# EasyEDA Pro project 毕业设计PCB板.eprj, schematic STM32103C8T6
Board Name: Board1; Create Date: 2024-12-30; Page Name: P1; Project Name: 毕业设计PCB板; Schematic Name: STM32103C8T6; Update Date: 2025-01-07; Add into BOM: yes; Company: 轻歌有限公司; Convert to PCB: yes; Page Size: A4; Version: V1.0
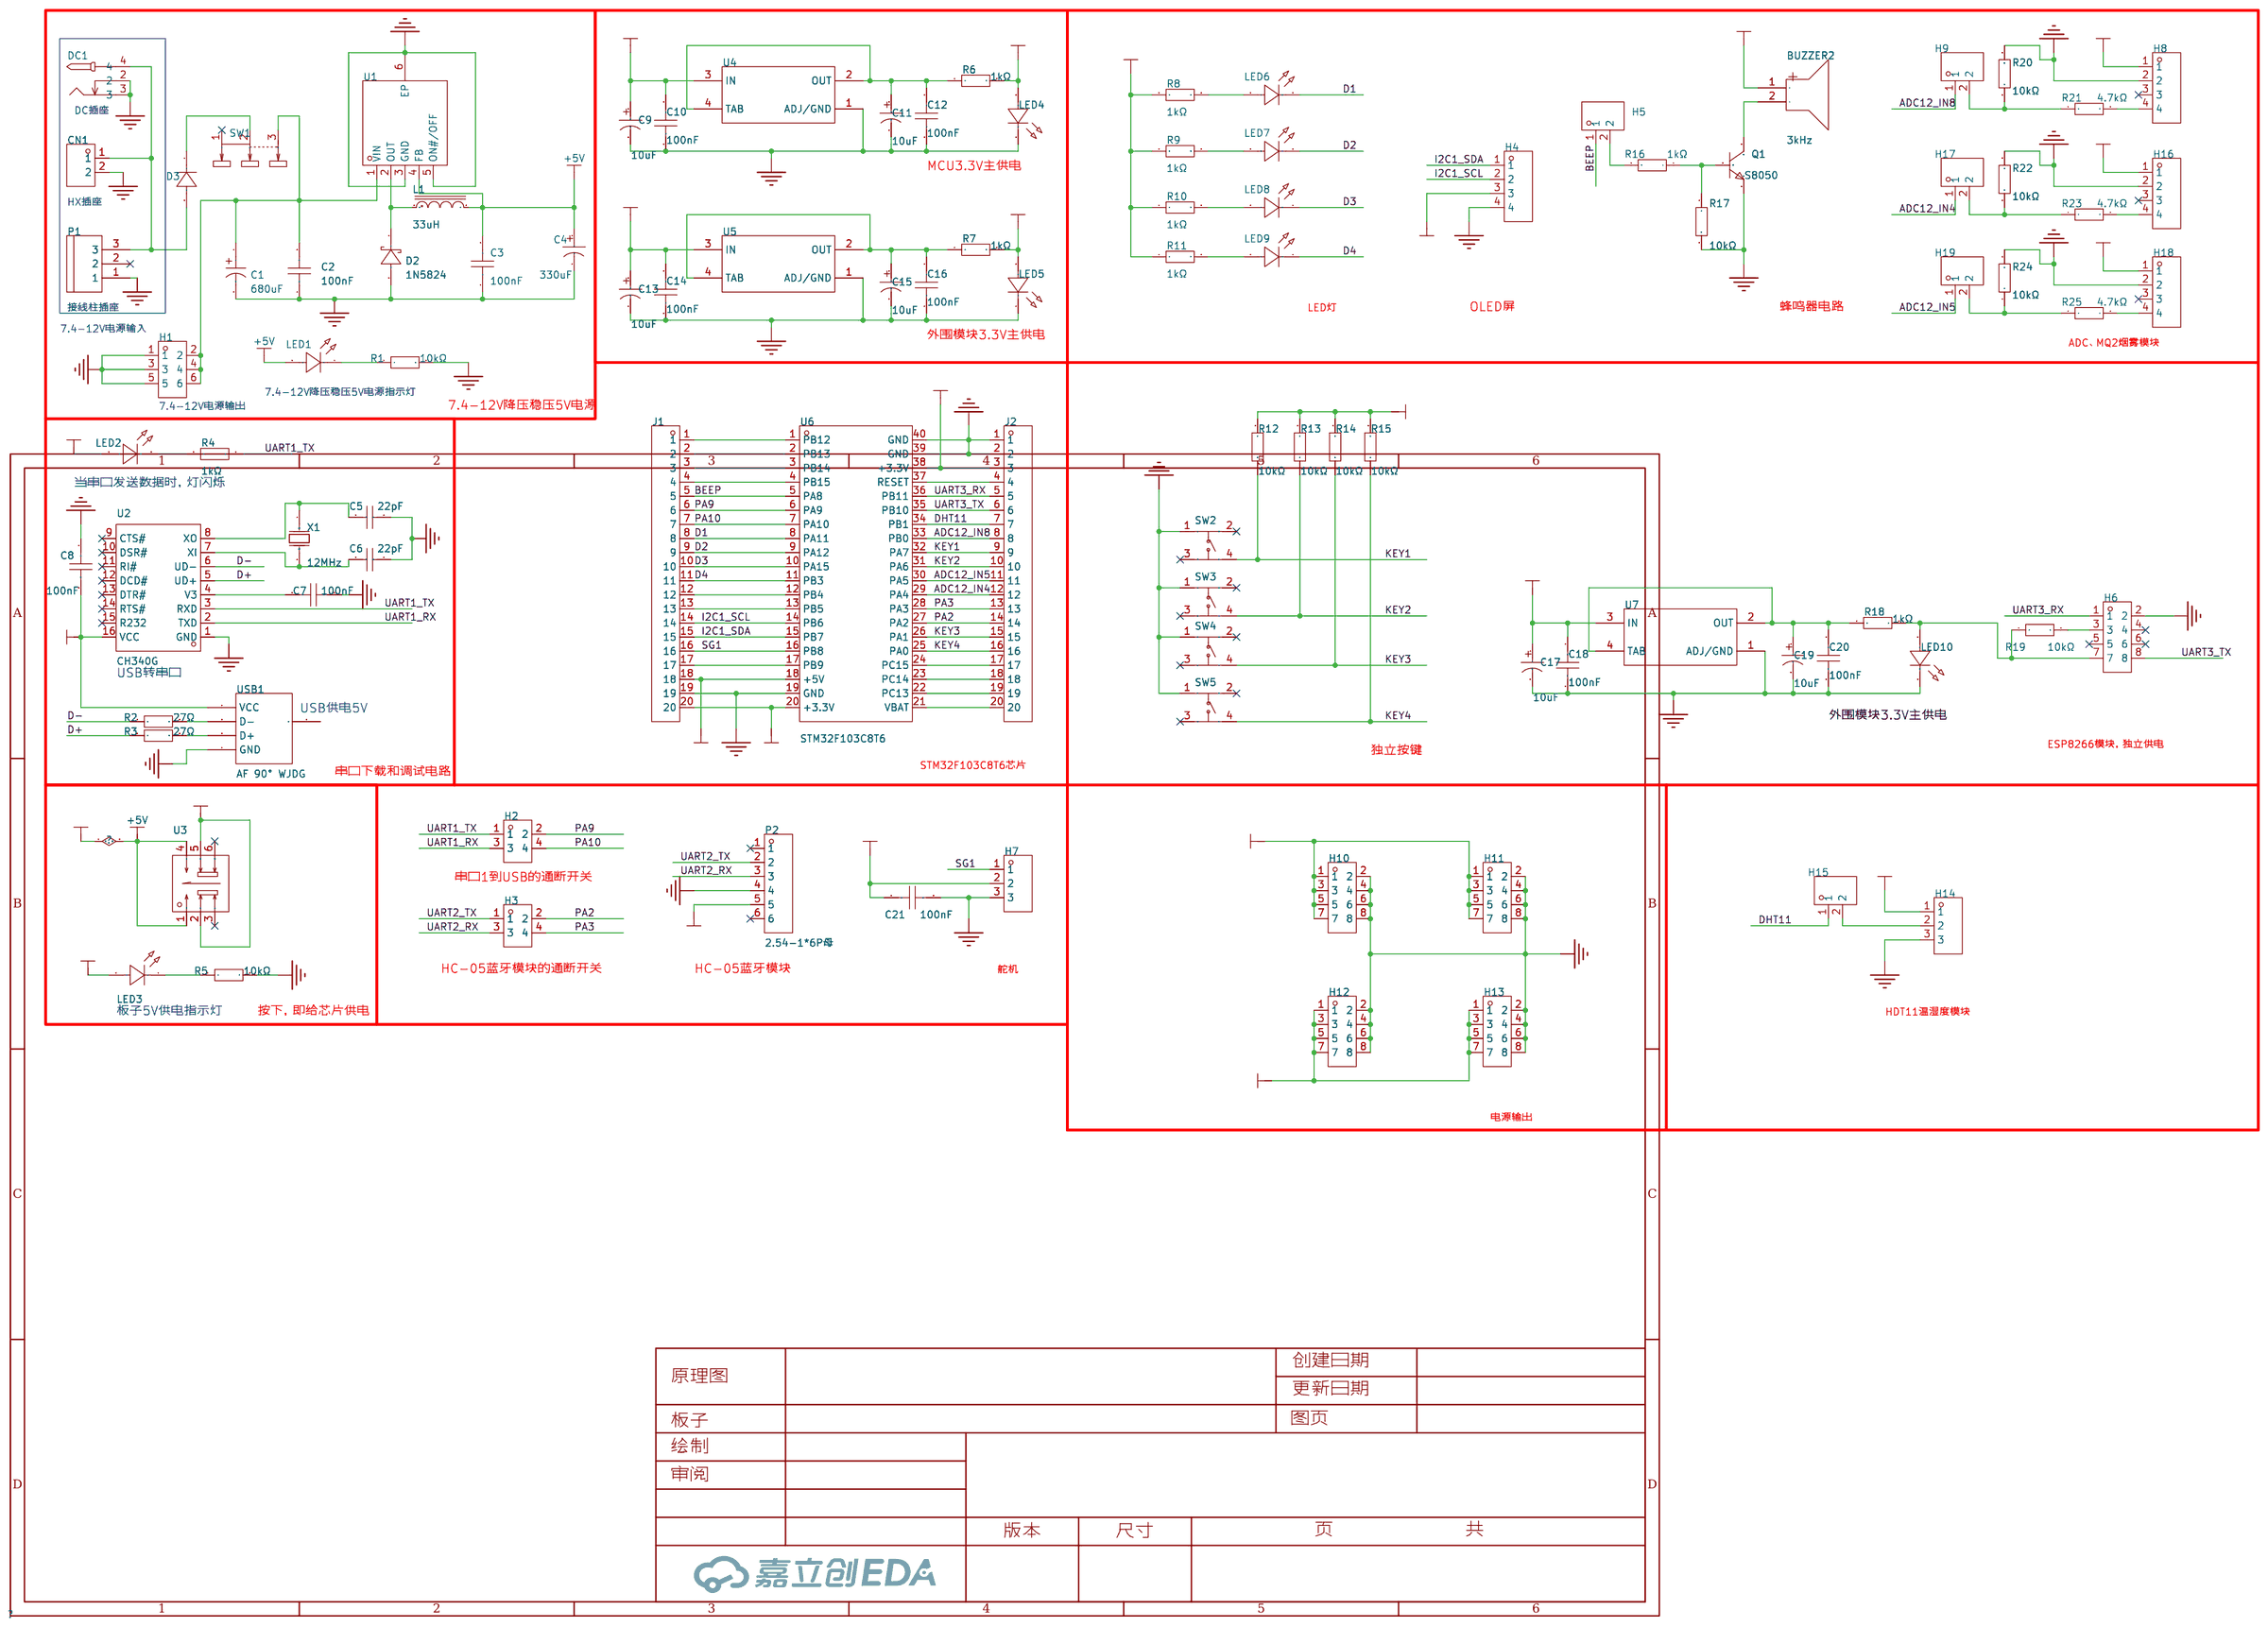
[diagram p0: schematic sheet]

## Parts
BUZZER2  3kHz  [BUZ-TH_BD9.0-P5.00-D0.6-FD]
C1  680uF  [CAP-TH_BD10.0-P5.00-D0.6-FD]
C2  100nF  [C0805]
C3  100nF  [C0805]
C4  330uF  [CAP-TH_BD8.0-P3.50-D0.6-FD]
C5  22pF  [C0805]
C6  22pF  [C0805]
C7  100nF  [C0805]
C8  100nF  [C0805]
C9  10uF  [CAP-TH_BD5.0-P2.00-D0.8-FD]
C10  100nF  [C0805]
C11  10uF  [CAP-TH_BD5.0-P2.00-D0.8-FD]
C12  100nF  [C0805]
C13  10uF  [CAP-TH_BD5.0-P2.00-D0.8-FD]
C14  100nF  [C0805]
C15  10uF  [CAP-TH_BD5.0-P2.00-D0.8-FD]
C16  100nF  [C0805]
C17  10uF  [CAP-TH_BD5.0-P2.00-D0.8-FD]
C18  100nF  [C0805]
C19  10uF  [CAP-TH_BD5.0-P2.00-D0.8-FD]
C20  100nF  [C0805]
C21  100nF  [C0805]
CN1  HX25003-2A  [CONN-TH_2P-P2.50_HX25003-2A]
D2  1N5824  [DO-27_BD5.3-L8.4-P12.40-D1.3-RD]
D3  1N4007  [DO-41_BD2.4-L4.7-P8.70-D0.8-RD]
DC1  DC-005 2.0  [DC-IN-TH_DC-5520-1]
H1  PZ254-2-03-Z-8.5  [HDR-TH_6P-P2.54-V-M-R2-C3-S2.54]
H2  PZ254V-12-4P  [HDR-TH_4P-P2.54-V-M-R2-C2-S2.54]
H3  PZ254V-12-4P  [HDR-TH_4P-P2.54-V-M-R2-C2-S2.54]
H4  2.54-1*4P母  [HDR-TH_4P-P2.54-V-F]
H5  PZ254V-11-02P  [HDR-TH_2P-P2.54-V-M]
H6  PM254V-12-08-H85  [HDR-TH_8P-P2.54-V-F-R2-C4-S2.54]
H7  PZ254V-11-03P  [HDR-TH_3P-P2.54-V-M]
H8  2.54-1*4P母  [HDR-TH_4P-P2.54-V-F]
H9  PZ254V-11-02P  [HDR-TH_2P-P2.54-V-M]
H10  PZ254V-12-8P  [HDR-TH_8P-P2.54-V-M-R2-C4-S2.54]
H11  PZ254V-12-8P  [HDR-TH_8P-P2.54-V-M-R2-C4-S2.54]
H12  PZ254V-12-8P  [HDR-TH_8P-P2.54-V-M-R2-C4-S2.54]
H13  PZ254V-12-8P  [HDR-TH_8P-P2.54-V-M-R2-C4-S2.54]
H14  PM254V-11-03-H85  [HDR-TH_3P-P2.54-V-F]
H15  PZ254V-11-02P  [HDR-TH_2P-P2.54-V-M]
H16  2.54-1*4P母  [HDR-TH_4P-P2.54-V-F]
H17  PZ254V-11-02P  [HDR-TH_2P-P2.54-V-M]
H18  2.54-1*4P母  [HDR-TH_4P-P2.54-V-F]
H19  PZ254V-11-02P  [HDR-TH_2P-P2.54-V-M]
J1  2.54-1*20P直针  [HDR-TH_20P-P2.54-V-M-1]
J2  2.54-1*20P直针  [HDR-TH_20P-P2.54-V-M-1]
L1  33uH  [IND-TH_BD7.5-P3.00-D0.6]
LED1  XL-302SURD  [LED-TH_BD3.8-P2.54-RD]
LED2  XL-302SURD  [LED-TH_BD3.8-P2.54-RD]
LED3  XL-302SURD  [LED-TH_BD3.8-P2.54-RD]
LED4  XL-302SURD  [LED-TH_BD3.8-P2.54-RD]
LED5  XL-302SURD  [LED-TH_BD3.8-P2.54-RD]
LED6  XL-302SURD  [LED-TH_BD3.8-P2.54-RD]
LED7  XL-302SURD  [LED-TH_BD3.8-P2.54-RD]
LED8  XL-302SURD  [LED-TH_BD3.8-P2.54-RD]
LED9  XL-302SURD  [LED-TH_BD3.8-P2.54-RD]
LED10  XL-302SURD  [LED-TH_BD3.8-P2.54-RD]
P1  WJ500V-5.08-3P  [CONN-TH_3P-P5.00_WJ500V-5.08-3P]
P2  2.54-1*6P母  [HDR-TH_6P-P2.54-V-F]
Q1  S8050  [TO-92-3_L4.5-W3.5-P1.27-L]
R1  10kΩ  [R0805]
R2  27Ω  [R0805]
R3  27Ω  [R0805]
R4  1kΩ  [R0805]
R5  10kΩ  [R0805]
R6  1kΩ  [R0805]
R7  1kΩ  [R0805]
R8  1kΩ  [R0805]
R9  1kΩ  [R0805]
R10  1kΩ  [R0805]
R11  1kΩ  [R0805]
R12  10kΩ  [R0805]
R13  10kΩ  [R0805]
R14  10kΩ  [R0805]
R15  10kΩ  [R0805]
R16  1kΩ  [R0805]
R17  10kΩ  [R0805]
R18  1kΩ  [R0805]
R19  10kΩ  [R0805]
R20  10kΩ  [R0805]
R21  4.7kΩ  [R0805]
R22  10kΩ  [R0805]
R23  4.7kΩ  [R0805]
R24  10kΩ  [R0805]
R25  4.7kΩ  [R0805]
SW1  SS-12D10L5  [SW-TH_SS-12D10L5]
SW2  KH-6X6X5H-STM  [SW-SMD_4P-L6.0-W6.0-P4.50-LS9.0-2]
SW3  KH-6X6X5H-STM  [SW-SMD_4P-L6.0-W6.0-P4.50-LS9.0-2]
SW4  KH-6X6X5H-STM  [SW-SMD_4P-L6.0-W6.0-P4.50-LS9.0-2]
SW5  KH-6X6X5H-STM  [SW-SMD_4P-L6.0-W6.0-P4.50-LS9.0-2]
U1  LM2596S-5.0  [TO-263-5_L10.2-W8.9-P1.70-BR]
U2  CH340G  [SOIC-16_L9.9-W3.9-P1.27-LS6.0-BL]
U3  PS-7054DVB-6PL  [SW-TH_6P-L7.0-W7.0-P2.00]
U4  LM1117S-3.3  [SOT-223-3_L6.5-W3.4-P2.30-LS7.0-BR]
U5  LM1117S-3.3  [SOT-223-3_L6.5-W3.4-P2.30-LS7.0-BR]
U6  STM32F103C8T6  [CONN-TH_L53.3-W22.9_STM32F103C8T6-CARD]
U7  LM1117S-3.3  [SOT-223-3_L6.5-W3.4-P2.30-LS7.0-BR]
USB1  AF 90° WJDG  [USB-A-TH_AF-WJDG]
X1  12MHz  [HC-49US_L11.5-W4.5-P4.88]

## Library data of the parts
BUZZER2 = HNB09A03: LCSC Part Name: 电磁式有源一体蜂鸣器HNB09A03; Supplier Part: C96102; Manufacturer: 华能; Supplier Footprint: 插件,D=9mm; JLCPCB Part Class: 扩展库; Datasheet: https://atta.szlcsc.com/upload/public/pdf/source/20170522/1495448326172.pdf; Supplier: LCSC; Oscillator Circuit: 有源(内含驱动线路); Technology Type: 电磁式; Operating Voltage: 1.5V~4.5V; Current Consumption: 30mA; Sound Pressure Level (SPL): 85dB@10cm; Diameter (φD): 9mm; Height: 5.5mm; Operating Temperature: -20℃~+70℃
C1 = ERS1VM681G16OT: LCSC Part Name: 680uF ±20% 35V; Supplier Part: C721283; Manufacturer: AISHI(艾华集团); Supplier Footprint: 插件,D10xL16mm; JLCPCB Part Class: 扩展库; Datasheet: https://atta.szlcsc.com/upload/public/pdf/source/20191015/C438940_4B8E60A742BB0AE40DDEF87A5C89089D.pdf; Supplier: LCSC; Tolerance: ±20%; Rated Voltage: 35V
C2 C3 C7 C8 C10 C12 C14 C16 C18 C20 C21 = CC0805KRX7R9BB104: LCSC Part Name: 100nF ±10% 50V; Supplier Part: C49678; Manufacturer: YAGEO(国巨); Supplier Footprint: 0805; JLCPCB Part Class: 基础库; Datasheet: https://atta.szlcsc.com/upload/public/pdf/source/20180224/C181747_15194369449651363981.pdf; Supplier: LCSC; Tolerance: ±10%; Voltage Rated: 50V; Temperature Coefficient: X7R
C4 = KM337M025F12RR0VH2FP0: LCSC Part Name: 330uF ±20% 25V; Supplier Part: C2051; Manufacturer: CX(承兴); Supplier Footprint: 插件,D8xL12mm; JLCPCB Part Class: 扩展库; Datasheet: https://atta.szlcsc.com/upload/public/pdf/source/20211027/06D6BA3719C264B639DC286D935D03EA.pdf; Supplier: LCSC; Tolerance: ±20%; Rated Voltage: 25V; Ripple Current: 340mA@120Hz; Lead Spacing: 3.5mm; φD: 8mm; L: 12mm; Lifetime @ Temp: 2000hrs@105℃
C5 C6 = CL21C220JBANNNC: LCSC Part Name: 22pF ±5% 50V; Supplier Part: C1804; Manufacturer: SAMSUNG(三星); Supplier Footprint: 0805; JLCPCB Part Class: 基础库; Datasheet: https://atta.szlcsc.com/upload/public/pdf/source/20160218/1457707763339.pdf; Supplier: LCSC; Tolerance: ±5%; Voltage Rated: 50V; Temperature Coefficient: C0G
C9 C11 C13 C15 C17 C19 = ERS1HM100D11OT: LCSC Part Name: 10uF ±20% 50V; Supplier Part: C106654; Manufacturer: AISHI(艾华集团); Supplier Footprint: 插件,D5xL11mm; JLCPCB Part Class: 扩展库; Datasheet: https://atta.szlcsc.com/upload/public/pdf/source/20191015/C438940_4B8E60A742BB0AE40DDEF87A5C89089D.pdf; Supplier: LCSC; Tolerance: ±20%; Rated Voltage: 50V; Lead Spacing: 2mm; φD: 5mm; L: 11mm; Lifetime @ Temp: 5000hrs@105℃
CN1 = HX25003-2A: LCSC Part Name: 1x2P 间距:2.5mm 直插 系列:XH; Supplier Part: C442299; Manufacturer: HX(红星); Supplier Footprint: 插件,P=2.5mm; JLCPCB Part Class: 扩展库; Datasheet: https://atta.szlcsc.com/upload/public/pdf/source/20191028/C442312_1520F9194999EF6509032948661325F7.pdf; Supplier: LCSC; Pins Structure: 1x2P; Pitch: 2.5mm; Mounting Style: 直插; Reference Series: XH; Number of Pins: 2P; Number of Rows: 1; Number of PINs Per Row: 2
D2 = 1N5824_C7503125: LCSC Part Name: 电压:30V 电流:5A; Supplier Part: C7503125; Manufacturer: FUXINSEMI(富芯森美); Supplier Footprint: DO-201AD; JLCPCB Part Class: 扩展库; Datasheet: https://atta.szlcsc.com/upload/public/pdf/source/20230904/20F3394C6D1B7A17743713246CA97DB3.pdf; Supplier: LCSC; Diode Configuration: 独立式; Forward Voltage (Vf@If): 550mV@5A; Reverse Voltage (Vr): 30V; Average Rectified Current (Io): 5A; Reverse Leakage Current (Ir): 500uA@30V; Peak forward surge current: 150A
D3 = 1N4007_C2985028: Supplier Part: C2985028; Manufacturer: GOODWORK(固得沃克); Supplier Footprint: DO-41; JLCPCB Part Class: 扩展库; Datasheet: https://atta.szlcsc.com/upload/public/pdf/source/20240805/02ED96714CFF9D9B94990135524CCB2D.pdf; Supplier: LCSC; Diode Configuration: 独立式; Forward Voltage (Vf@If): 1V@1A; Reverse Voltage (Vr): 1kV; Rectified Current: 1A; Reverse Leakage Current (Ir): 5uA@1kV
DC1 = DC-005 2.0: LCSC Part Name: DC电源插座 内径:2mm 外径:6.4mm; Supplier Part: C16214; Manufacturer: BOOMELE(博穆精密); Supplier Footprint: 插件; JLCPCB Part Class: 扩展库; Datasheet: https://atta.szlcsc.com/upload/public/pdf/source/20230822/A395081E7D04348211A5D528B2AFD8E0.pdf; Supplier: LCSC; Connector Type: DC电源插座; Mounting Style: 弯插; Inside Contact Diameter: 2mm; Outside Contact Diameter: 6.4mm; Current Rating (Max): 1A; Voltage Rating (Max): 12V; Operating Temperature Range: -25℃~+85℃
H1 = PZ254-2-03-Z-8.5_C2894964: LCSC Part Name: 2x3P 间距:2.54mm 方针 直插; Supplier Part: C2894964; Manufacturer: HCTL(华灿天禄); Supplier Footprint: 插件,P=2.54mm; JLCPCB Part Class: 扩展库; Datasheet: https://atta.szlcsc.com/upload/public/pdf/source/20230609/5BA09C8BEB9B31376F8BF6032FF67CAC.pdf; Supplier: LCSC; Pin Structure: 2x3P; Pitch: 2.54mm; Row Spacing: 2.54mm; Circluar Pins/Square Pins: 方针; Mounting Type: 直插; Number of Rows: 双排; Number of Pins: 6P; Current Rating (Max): 3A; Length of Mating Pin: 6mm; Insulation Height: 2.5mm; Length of End Connection Pin: 3mm; Contact Material: 黄铜; Operating Temperature Range: -40℃~+105℃; Soldering Temperature(Max): 260℃@10S; Color: 黑色
H2 H3 = PZ254V-12-4P: LCSC Part Name: 间距:2.54mm 2x2P 直插 方针; Supplier Part: C492419; Manufacturer: XFCN(兴飞); Supplier Footprint: 插件,P=2.54mm; JLCPCB Part Class: 扩展库; Datasheet: https://atta.szlcsc.com/upload/public/pdf/source/20200309/C492419_0001C06E73AFF21BD0ED3D7CEEF46D29.pdf; Supplier: LCSC; Pin Structure: 2x2P; Pitch: 2.54mm; Row Spacing: 2.54mm; Circluar Pins/Square Pins: 方针; Mounting Type: 直插; Number of Rows: 双排; Number of Pins: 4P; Length of Mating Pin: 6mm; Insulation Height: 2.5mm; Length of End Connection Pin: 3mm; Contact Material: 黄铜; Operating Temperature Range: -40℃~+105℃; Color: 黑色
H4 H8 H16 H18 = 2.54-1*4P母: LCSC Part Name: 间距:2.54mm 1x4P 直插; Supplier Part: C2718488; Manufacturer: BOOMELE(博穆精密); Supplier Footprint: 插件,P=2.54mm; JLCPCB Part Class: 扩展库; Datasheet: https://atta.szlcsc.com/upload/public/pdf/source/20210301/C2718488_F4427B881E42CAA8DDB0B1C12B3A522C.pdf; Supplier: LCSC; Holes Structure: 1x4P; Pitch: 2.54mm; Circular Hole / Square Hole: 方孔; Mounting Type: 直插; Number of Rows: 单排; Number of Holes: 4P; Current Rating (Max): 3A; Holes Direction: 顶部; Contact Material: 青铜; Operating Temperature Range: -40℃~+105℃
H5 H9 H15 H17 H19 = PZ254V-11-02P: LCSC Part Name: 间距:2.54mm 1x2P 直插 方针; Supplier Part: C492401; Manufacturer: XFCN(兴飞); Supplier Footprint: 插件,P=2.54mm; JLCPCB Part Class: 扩展库; Datasheet: https://atta.szlcsc.com/upload/public/pdf/source/20200309/C492401_A812433581A9B211A7FFA413ADDFF0E5.pdf; Supplier: LCSC; Pin Structure: 1x2P; Pitch: 2.54mm; Circluar Pins/Square Pins: 方针; Mounting Type: 直插; Number of Rows: 单排; Number of Pins: 2P; Length of Mating Pin: 6mm; Insulation Height: 2.5mm; Length of End Connection Pin: 3mm; Contact Material: 黄铜; Operating Temperature Range: -40℃~+105℃; Color: 黑色
H6 = PM254V-12-08-H85: LCSC Part Name: 间距:2.54mm 2x4P 直插; Supplier Part: C2834799; Manufacturer: XFCN(兴飞); Supplier Footprint: 插件,P=2.54mm; JLCPCB Part Class: 扩展库; Datasheet: https://atta.szlcsc.com/upload/public/pdf/source/20200309/C492399_8C441E2934FBB604A89B37A68AA45ECF.pdf; Supplier: LCSC; Holes Structure: 2x4P; Pitch: 2.54mm; Row Spacing: 2.54mm; Circular Hole / Square Hole: 方孔; Mounting Type: 直插; Number of Rows: 双排; Number of Holes: 8P; Current Rating (Max): 3A; Voltage Rating (Max): 250V; Holes Direction: 顶部; Insulation Height: 8.5mm; Operating Temperature Range: -40℃~+105℃
H7 = PZ254V-11-03P: LCSC Part Name: 间距:2.54mm 1x3P 直插 方针; Supplier Part: C2937625; Manufacturer: XFCN(兴飞); Supplier Footprint: 插件,P=2.54mm; JLCPCB Part Class: 扩展库; Datasheet: https://atta.szlcsc.com/upload/public/pdf/source/20200309/C492402_8335C3D49C4E4C618838D59BB1D024C1.pdf; Supplier: LCSC; Pin Structure: 1x3P; Pitch: 2.54mm; Circluar Pins/Square Pins: 方针; Mounting Type: 直插; Number of Rows: 单排; Number of Pins: 3P; Current Rating (Max): 3A; Voltage Rating (Max): 250V; Length of Mating Pin: 6mm; Insulation Height: 2.5mm; Length of End Connection Pin: 3mm; Operating Temperature Range: -40℃~+105℃; Color: 黑色
H10-H13 = PZ254V-12-8P: LCSC Part Name: 间距:2.54mm 2x4P 直插 方针; Supplier Part: C492421; Manufacturer: XFCN(兴飞); Supplier Footprint: 插件,P=2.54mm; JLCPCB Part Class: 扩展库; Datasheet: https://atta.szlcsc.com/upload/public/pdf/source/20200309/C492421_DC8A206AF99CD7755BD4A5B0BC48200B.pdf; Supplier: LCSC; Pin Structure: 2x4P; Pitch: 2.54mm; Row Spacing: 2.54mm; Circluar Pins/Square Pins: 方针; Mounting Type: 直插; Number of Rows: 双排; Number of Pins: 8P; Length of Mating Pin: 6mm; Insulation Height: 2.5mm; Length of End Connection Pin: 3mm; Contact Material: 黄铜; Operating Temperature Range: -40℃~+105℃; Color: 黑色
H14 = PM254V-11-03-H85: LCSC Part Name: 间距:2.54mm 1x3P 直插; Supplier Part: C541850; Manufacturer: XFCN(兴飞); Supplier Footprint: 插件,P=2.54mm; JLCPCB Part Class: 扩展库; Datasheet: https://atta.szlcsc.com/upload/public/pdf/source/20200518/C541849_85853D71FC67C51915A806977A588FDA.pdf; Supplier: LCSC; Holes Structure: 1x3P; Pitch: 2.54mm; Mounting Type: 直插; Number of Rows: 单排; Number of Holes: 3P; Contact Material: 黄铜
J1 J2 = 2.54-1*20P直针: LCSC Part Name: 间距:2.54mm 1x20P 直插 方针; Supplier Part: C50981; Manufacturer: BOOMELE(博穆精密); Supplier Footprint: 插件,P=2.54mm; JLCPCB Part Class: 扩展库; Datasheet: https://atta.szlcsc.com/upload/public/pdf/source/20151109/1457707572883.pdf; Supplier: LCSC; Pin Structure: 1x20P; Pitch: 2.54mm; Circluar Pins/Square Pins: 方针; Mounting Type: 直插; Number of Rows: 单排; Number of Pins: 20P; Current Rating (Max): 3A; Contact Material: 黄铜; Operating Temperature Range: -40℃~+105℃; Color: 黑色
L1 = PDPTAT0608-330M: LCSC Part Name: 33uH ±20% 1.7A 工字电感; Supplier Part: C5119594; Manufacturer: PROD(谱罗德); Supplier Footprint: 插件,D7.5xL10mm; JLCPCB Part Class: 扩展库; Datasheet: https://atta.szlcsc.com/upload/public/pdf/source/20220811/05DB99A2C788B818DCFC0C4B53D9481B.pdf; Supplier: LCSC; Tolerance: ±20%; Current - Saturation (Isat): 1.7A; DC Resistance: 90mΩ; Type: 工字电感
LED1-LED10 = XL-302SURD: Supplier Part: C2895470; Manufacturer: XINGLIGHT(成兴光); Supplier Footprint: 插件,D=3mm; JLCPCB Part Class: 扩展库; Datasheet: https://atta.szlcsc.com/upload/public/pdf/source/20240112/E1E2B82945FD635E4907401DDE6D4922.pdf; Supplier: LCSC; Lamp Holder Type: 3mm圆形灯头; Emitted Color: 红色; Power Dissipation: 80mW; Forward Current: 30mA; Dominant Wavelength: 615nm~620nm; Peak Wavelength: 625nm; Lens Color: 红色透镜; Viewing Angle: 50°; Operating Temperature: -25℃~+85℃
P1 = WJ500V-5.08-3P: LCSC Part Name: 5.08mm 1x3P 排数:1 每排P数:3 直插; Supplier Part: C72334; Manufacturer: KANGNEX(康奈克斯电气); Supplier Footprint: 插件,P=5.08mm; JLCPCB Part Class: 扩展库; Datasheet: https://atta.szlcsc.com/upload/public/pdf/source/20191225/C72334_8A5EF831D67650233B6B1E3F2BC06274.pdf; Supplier: LCSC; Structure: 1x3P; Pitch: 5.08mm; Color: 绿色; Mounting Style: 直插; Current Rating (Max): 18A; Voltage Rating (Max): 250V; Number of Pins: 3P; Number of Rows: 1; Wire Gauge - AWG: 14~30; Wire Gauge - mm2: 2.5; Number of PINs Per Row: 3; Operating Temperature Range: -40℃~+105℃
P2 = 2.54-1*6P母: LCSC Part Name: 间距:2.54mm 1x6P 直插; Supplier Part: C40877; Manufacturer: BOOMELE(博穆精密); Supplier Footprint: 插件,P=2.54mm; JLCPCB Part Class: 扩展库; Datasheet: https://atta.szlcsc.com/upload/public/pdf/source/20210301/C2718488_F4427B881E42CAA8DDB0B1C12B3A522C.pdf; Supplier: LCSC; Holes Structure: 1x6P; Pitch: 2.54mm; Mounting Type: 直插; Number of Rows: 单排; Number of Holes: 6P
Q1 = S8050_C2931492: LCSC Part Name: NPN 电流:500mA 耐压:25V; Supplier Part: C2931492; Manufacturer: JSMSEMI(杰盛微); Supplier Footprint: TO-92-3; JLCPCB Part Class: 扩展库; Datasheet: https://atta.szlcsc.com/upload/public/pdf/source/20240105/D4E57AD221AC7DEA1E31B953388D993E.pdf; Supplier: LCSC; Transistor Type: NPN; Collector Current (Ic): 500mA; Collector-Emitter Breakdown Voltage (Vceo): 25V; Power Dissipation (Pd): 625mW; DC Current Gain (hFE@Ic,Vce): 160@50mA,1V; Transition Frequency (fT): 150MHz; Collector Cut-Off Current (Icbo): 100nA; Collector-Emitter Saturation Voltage (VCE(sat)@Ic,Ib): 600mV@500mA,50mA
R1 R4-R25 = 0805W8F1002T5E_C17414: LCSC Part Name: 10kΩ ±1% 125mW 厚膜电阻; Supplier Part: C17414; Manufacturer: UNI-ROYAL(厚声); Manufacturer Part: 0805W8F1002T5E; Supplier Footprint: 0805; JLCPCB Part Class: 基础库; Datasheet: https://atta.szlcsc.com/upload/public/pdf/source/20200306/C422600_1E6D84923E4A46A82E41ADD87F860B5C.pdf; Supplier: LCSC; Type: 厚膜电阻; Tolerance: ±1%; Power(Watts): 125mW; Overload Voltage (Max): 150V; Temperature Coefficient: ±100ppm/℃; Operating Temperature Range: -55℃~+155℃
R2 R3 = 0805W8F270JT5E: LCSC Part Name: 27Ω ±1% 125mW 厚膜电阻; Supplier Part: C17594; Manufacturer: UNI-ROYAL(厚声); Supplier Footprint: 0805; JLCPCB Part Class: 扩展库; Datasheet: https://atta.szlcsc.com/upload/public/pdf/source/20200306/C422600_1E6D84923E4A46A82E41ADD87F860B5C.pdf; Supplier: LCSC; Type: 厚膜电阻; Tolerance: ±1%; Power(Watts): 125mW; Overload Voltage (Max): 150V; Temperature Coefficient: ±100ppm/℃; Operating Temperature Range: -55℃~+155℃
SW1 = SS-12D10L5: LCSC Part Name: 柄长5mm 直插双档 滑动开关; Supplier Part: C319012; Manufacturer: XKB Connectivity(中国星坤); Supplier Footprint: 插件; JLCPCB Part Class: 扩展库; Datasheet: https://atta.szlcsc.com/upload/public/pdf/source/20211009/D6412F37AABE6F9459A6EE7FA4DAEADB.pdf; Supplier: LCSC; Circuit: 单刀双掷; Actuator Style: 矩形柱状; Pin Style: PC引脚; Switch Length: 13mm; Switch Width: 6.8mm; Switch Height: 6.4mm; Mounting Style: 直插; Actuator Color: 黑色; Current Rating (DC): 3A; Voltage Rating (DC): 125V; Current Rating (AC): 3A; Voltage Rating (AC): 125V; Mechanical Life: 1万次; Operating Temperature: -40℃~+85℃
SW2-SW5 = KH-6X6X5H-STM: LCSC Part Name: 6*6*5mm 立贴 轻触开关; Supplier Part: C2837531; Manufacturer: kinghelm(金航标); Supplier Footprint: SMD; JLCPCB Part Class: 扩展库; Datasheet: https://atta.szlcsc.com/upload/public/pdf/source/20210608/C2837531_45E87AB996CE723B09405FF2EA209C4C.pdf; Supplier: LCSC; Circuit: 单刀单掷; Actuator Style: 圆形按钮; Mounting Style: 立贴; Switch Length: 6mm; Switch Width: 6mm; Switch Height: 5mm; Strike Gundam: 不带; Contact Current: 50mA; Voltage Rating (DC): 12V; Actuator/Cap Color: 黑色; Pin Style: 鸥翼型; Mechanical Life: 8万次
U1 = LM2596S-5.0_C347421: LCSC Part Name: 3A降压稳压器; Supplier Part: C347421; Manufacturer: UMW(友台半导体); Supplier Footprint: TO-263-5; JLCPCB Part Class: 扩展库; Datasheet: https://atta.szlcsc.com/upload/public/pdf/source/20241113/7515F50B4FEE0270D4DE7078364C87FA.pdf; Supplier: LCSC; Function: 降压型; Output Type: 固定; Input Voltage: 7V~40V; Output Voltage: 5V; Output Current: 3A; Switching Frequency: 150kHz; Operating Temperature: -40℃~+125℃@(TA); Synchronous Rectification: 否; Number of Outputs: 1; Topology: 降压式; Quiescent Current (Iq): 80uA; Switch tube (built-in/external): 内置
U2 = CH340G: LCSC Part Name: USB转串口芯片CH340; Supplier Part: C14267; Manufacturer: WCH(南京沁恒); Supplier Footprint: SOP-16; JLCPCB Part Class: 扩展库; Datasheet: https://atta.szlcsc.com/upload/public/pdf/source/20240313/8510303D24D987FBF1AD30058571F10E.pdf; Supplier: LCSC; Applications Function: USB转UART; Protocol: USB 2.0; Supply Voltage: 5V；3.3V; Data Rate: 2Mbps; Operating Temperature: -40℃~+85℃
U3 = PS-7054DVB-6PL: LCSC Part Name: 7*7自锁按键开关; Supplier Part: C22363819; Manufacturer: G-Switch(品赞); Supplier Footprint: 插件-6P,7x7mm; JLCPCB Part Class: 扩展库; Datasheet: https://atta.szlcsc.com/upload/public/pdf/source/20240319/F2B7FB2723231C6F1D5F9BB35EBA5342.pdf; Supplier: LCSC; Self Lock / No Lock: 自锁; Operating Force: 2.5N
U4 U5 U7 = LM1117S-3.3: LCSC Part Name: 输入12V 输出3.3V 1A; Supplier Part: C126027; Manufacturer: HTC; Supplier Footprint: SOT-223-3; JLCPCB Part Class: 扩展库; Datasheet: https://atta.szlcsc.com/upload/public/pdf/source/20170814/C126029_1502678374361885901.pdf; Supplier: LCSC; Output Type: 固定; Maximum Input Voltage: 12V; Output Voltage: 3.3V; MAX Output Current: 1A; Power Supply Rejection Ratio (PSRR): 75dB@(120Hz); Dropout Voltage: 1.3V@(1A); Output Polarity: 正极; Number of Outputs: 1
U6 = LCKFB-DKX-STM32F103C8T6: LCSC Part Name: 立创·地阔星-STM32F103C8T6开发板; Supplier Part: C22396880; Manufacturer: 立创开发板; JLCPCB Part Class: 扩展库; Datasheet: https://atta.szlcsc.com/upload/public/pdf/source/20240801/7EEF69F7480DF7C6DA98696664D658D4.pdf; Supplier: LCSC
USB1 = AF 90° WJDG: LCSC Part Name: Type-A 母 弯插; Supplier Part: C456018; Manufacturer: SHOU HAN(首韩); Supplier Footprint: 插件; JLCPCB Part Class: 扩展库; Datasheet: https://atta.szlcsc.com/upload/public/pdf/source/20241125/1CC41152EE29FFE03A5868591A920D3B.pdf; Supplier: LCSC; Connector Type: Type-A; Standard: USB 2.0; Gender: 母; Mounting Style: 弯插; Number of Contacts: 4P; Number of Ports: 1; Current Rating - Power (Max): 1.5A; Rated Voltage (Max): 30V; Connect-Disconnect Life: 5千次; Length: 14mm; Core Colour: 白色; Operating Temperature Range: -25℃~+85℃
X1 = X49SD12MSD2SC: LCSC Part Name: 12MHz ±20ppm 20pF; Supplier Part: C16369; Manufacturer: YXC(扬兴晶振); Supplier Footprint: HC-49S; JLCPCB Part Class: 扩展库; Datasheet: https://atta.szlcsc.com/upload/public/pdf/source/20240329/977D7F2434F98B2BE33270BB9FF3D86D.pdf; Supplier: LCSC; Crystal Type: 直插晶振; Normal temperature Frequency Tolerance: ±20ppm; External load capacitor: 20pF; Frequency Stability(Full temperature range): ±30ppm; Operating Temperature: -20℃~+70℃

## Nets
+5V: C3.2 C4.1 C8.2 L1.2 LED1.2(A) LED2.2(A) U1.4(FB) U2.16(VCC) U3.1 U3.4 USB1.1(VCC)
GND: C1.2 C2.1 C3.1 C4.2 C5.2 C6.2 C7.1 C8.1 C9.2 C10.2 C11.2 C12.2 C13.2 C14.2 C15.2 C16.2 C17.2 C18.2 C19.2 C20.2 C21.2 CN1.2 D2.2(A) DC1.2 DC1.3 H1.1 H1.3 H1.5 H4.4 H6.2 H7.3 H8.2 H10.2 H10.4 H10.6 H10.8 H11.2 H11.4 H11.6 H11.8 H12.2 H12.4 H12.6 H12.8 H13.2 H13.4 H13.6 H13.8 H14.3 H16.2 H18.2 J1.19 J2.1 J2.2 LED4.1(K) LED5.1(K) LED10.1(K) P1.1 P2.4 Q1.1(E) R1.2 R5.2 R17.2 R20.2 R22.2 R24.2 SW2.1 SW3.1 SW4.1 SW5.1 U1.3(GND) U1.5(ON#/OFF) U1.6(EP) U2.1(GND) U4.1(ADJ/GND) U5.1(ADJ/GND) U6.19(GND) U6.39(GND) U6.40(GND) U7.1(ADJ/GND) USB1.4(GND)
VCC-5V: BUZZER2.1(+) C9.1 C10.1 C13.1 C14.1 C17.1 C18.1 C21.1 H7.2 H8.1 H10.1 H10.3 H10.5 H10.7 H11.1 H11.3 H11.5 H11.7 H14.1 H16.1 H18.1 J1.18 LED3.2(A) P2.5 U3.2 U3.5 U4.3(IN) U5.3(IN) U6.18(+5V) U7.3(IN)
VCC-EX: H4.3 H12.1 H12.3 H12.5 H12.7 H13.1 H13.3 H13.5 H13.7 LED5.2(A) R7.2
VCC-MCU: J1.20 J2.3 LED4.2(A) R6.2 R8.1 R9.1 R10.1 R11.1 R12.2 R13.2 R14.2 R15.2 U6.20(+3.3V) U6.38(+3.3V)
ADC12_IN4: H17.1 J2.12 U6.29(PA4)
ADC12_IN5: H19.1 J2.11 U6.30(PA5)
ADC12_IN8: H9.1 J2.8 U6.33(PB0)
BEEP: H5.1 J1.5 U6.5(PA8)
D1: J1.8 LED6.1(K) U6.8(PA11)
D2: J1.9 LED7.1(K) U6.9(PA12)
D3: J1.10 LED8.1(K) U6.10(PA15)
D4: J1.11 LED9.1(K) U6.11(PB3)
D+: R3.1 U2.5(UD+)
D-: R2.1 U2.6(UD-)
DHT11: H15.1 J2.7 U6.34(PB1)
I2C1_SCL: H4.2 J1.14 U6.14(PB6)
I2C1_SDA: H4.1 J1.15 U6.15(PB7)
KEY1: J2.9 R12.1 SW2.4 U6.32(PA7)
KEY2: J2.10 R13.1 SW3.4 U6.31(PA6)
KEY3: J2.15 R14.1 SW4.4 U6.26(PA1)
KEY4: J2.16 R15.1 SW5.4 U6.25(PA0)
PA2: H3.2 J2.14 U6.27(PA2)
PA3: H3.4 J2.13 U6.28(PA3)
PA9: H2.2 J1.6 U6.6(PA9)
PA10: H2.4 J1.7 U6.7(PA10)
SG1: H7.1 J1.16 U6.16(PB8)
UART1_RX: H2.3 U2.2(TXD)
UART1_TX: H2.1 R4.2 U2.3(RXD)
UART2_RX: H3.3 P2.3
UART2_TX: H3.1 P2.2
UART3_RX: H6.1 J2.5 U6.36(PB11)
UART3_TX: H6.8 J2.6 U6.35(PB10)
$1N694: D3.1(K) SW1.2
$1N706: CN1.1 D3.2(A) DC1.4 P1.3
$1N761: C1.1 C2.2 H1.2 H1.4 H1.6 SW1.3 U1.1(VIN)
$1N1576: D2.1(K) L1.1 U1.2(OUT)
$1N1960: LED1.1(K) R1.1
$1N2428: R3.2 USB1.3(D+)
$1N2433: R2.2 USB1.2(D-)
$1N2459: C6.1 U2.7(XI) X1.2(OSC2)
$1N2861: C7.2 U2.4(V3)
$1N2986: LED2.1(K) R4.1
$1N3014: C5.1 U2.8(XO) X1.1(OSC1)
$1N3837: LED3.1(K) R5.1
$1N4420: C11.1 C12.1 R6.1 U4.2(OUT) U4.4(TAB)
$1N4944: C15.1 C16.1 R7.1 U5.2(OUT) U5.4(TAB)
$1N5554: J1.1 U6.1(PB12)
$1N5558: J1.2 U6.2(PB13)
$1N5563: J1.3 U6.3(PB14)
$1N5568: J1.4 U6.4(PB15)
$1N5611: J1.12 U6.12(PB4)
$1N5616: J1.13 U6.13(PB5)
$1N5639: J1.17 U6.17(PB9)
$1N5662: J2.20 U6.21(VBAT)
$1N5667: J2.19 U6.22(PC13)
$1N5672: J2.18 U6.23(PC14)
$1N5677: J2.17 U6.24(PC15)
$1N5787: J2.4 U6.37(RESET)
$1N6236: LED6.2(A) R8.2
$1N6373: LED7.2(A) R9.2
$1N6456: LED8.2(A) R10.2
$1N6539: LED9.2(A) R11.2
$1N7955: Q1.2(B) R16.1 R17.1
$1N8079: H5.2 R16.2
$1N8113: BUZZER2.2(-) Q1.3(C)
$1N10922: C19.1 C20.1 R18.1 U7.2(OUT) U7.4(TAB)
$1N10923: H6.7 LED10.2(A) R18.2 R19.1
$1N11076: H6.3 R19.2
$1N14185: H8.4 R21.2
$1N14299: H9.2 R20.1 R21.1
$1N14888: H14.2 H15.2
$1N15101: H16.4 R23.2
$1N15107: H17.2 R22.1 R23.1
$1N15321: H18.4 R25.2
$1N15327: H19.2 R24.1 R25.1

Not connected (* = marked no-connect by the designer): H6 4* 5* 6*; H8 3*; H16 3*; H18 3*; P1 2*; P2 1* 6*; SW1 1*; SW2 2* 3*; SW3 2* 3*; SW4 2* 3*; SW5 2* 3*; U2 9(CTS#)* 10(DSR#)* 11(RI#)* 12(DCD#)* 13(DTR#)* 14(RTS#)* 15(R232)*; U3 3* 6*; USB1 5(SHLD)

## Notes on the sheet
- DC插座
- MCU3.3V主供电
- HX插座
- 接线柱插座
- LED灯
- OLED屏
- 蜂鸣器电路
- 7.4-12V电源输入
- 外围模块3.3V主供电
- ADC、MQ2烟雾模块
- 7.4-12V降压稳压5V电源指示灯
- 7.4-12V电源输出
- 7.4-12V降压稳压5V电源
- 当串口发送数据时，灯闪烁
- USB转串口
- USB供电5V
- 外围模块3.3V主供电
- ESP8266模块，独立供电
- 独立按键
- 串口下载和调试电路
- STM32F103C8T6芯片
- 串口1到USB的通断开关
- HC-05蓝牙模块的通断开关
- HC-05蓝牙模块
- 舵机
- 板子5V供电指示灯
- 按下，即给芯片供电
- HDT11温湿度模块
- 电源输出
